# EAGLE design boardBase3 (EAGLE 8.4.0)
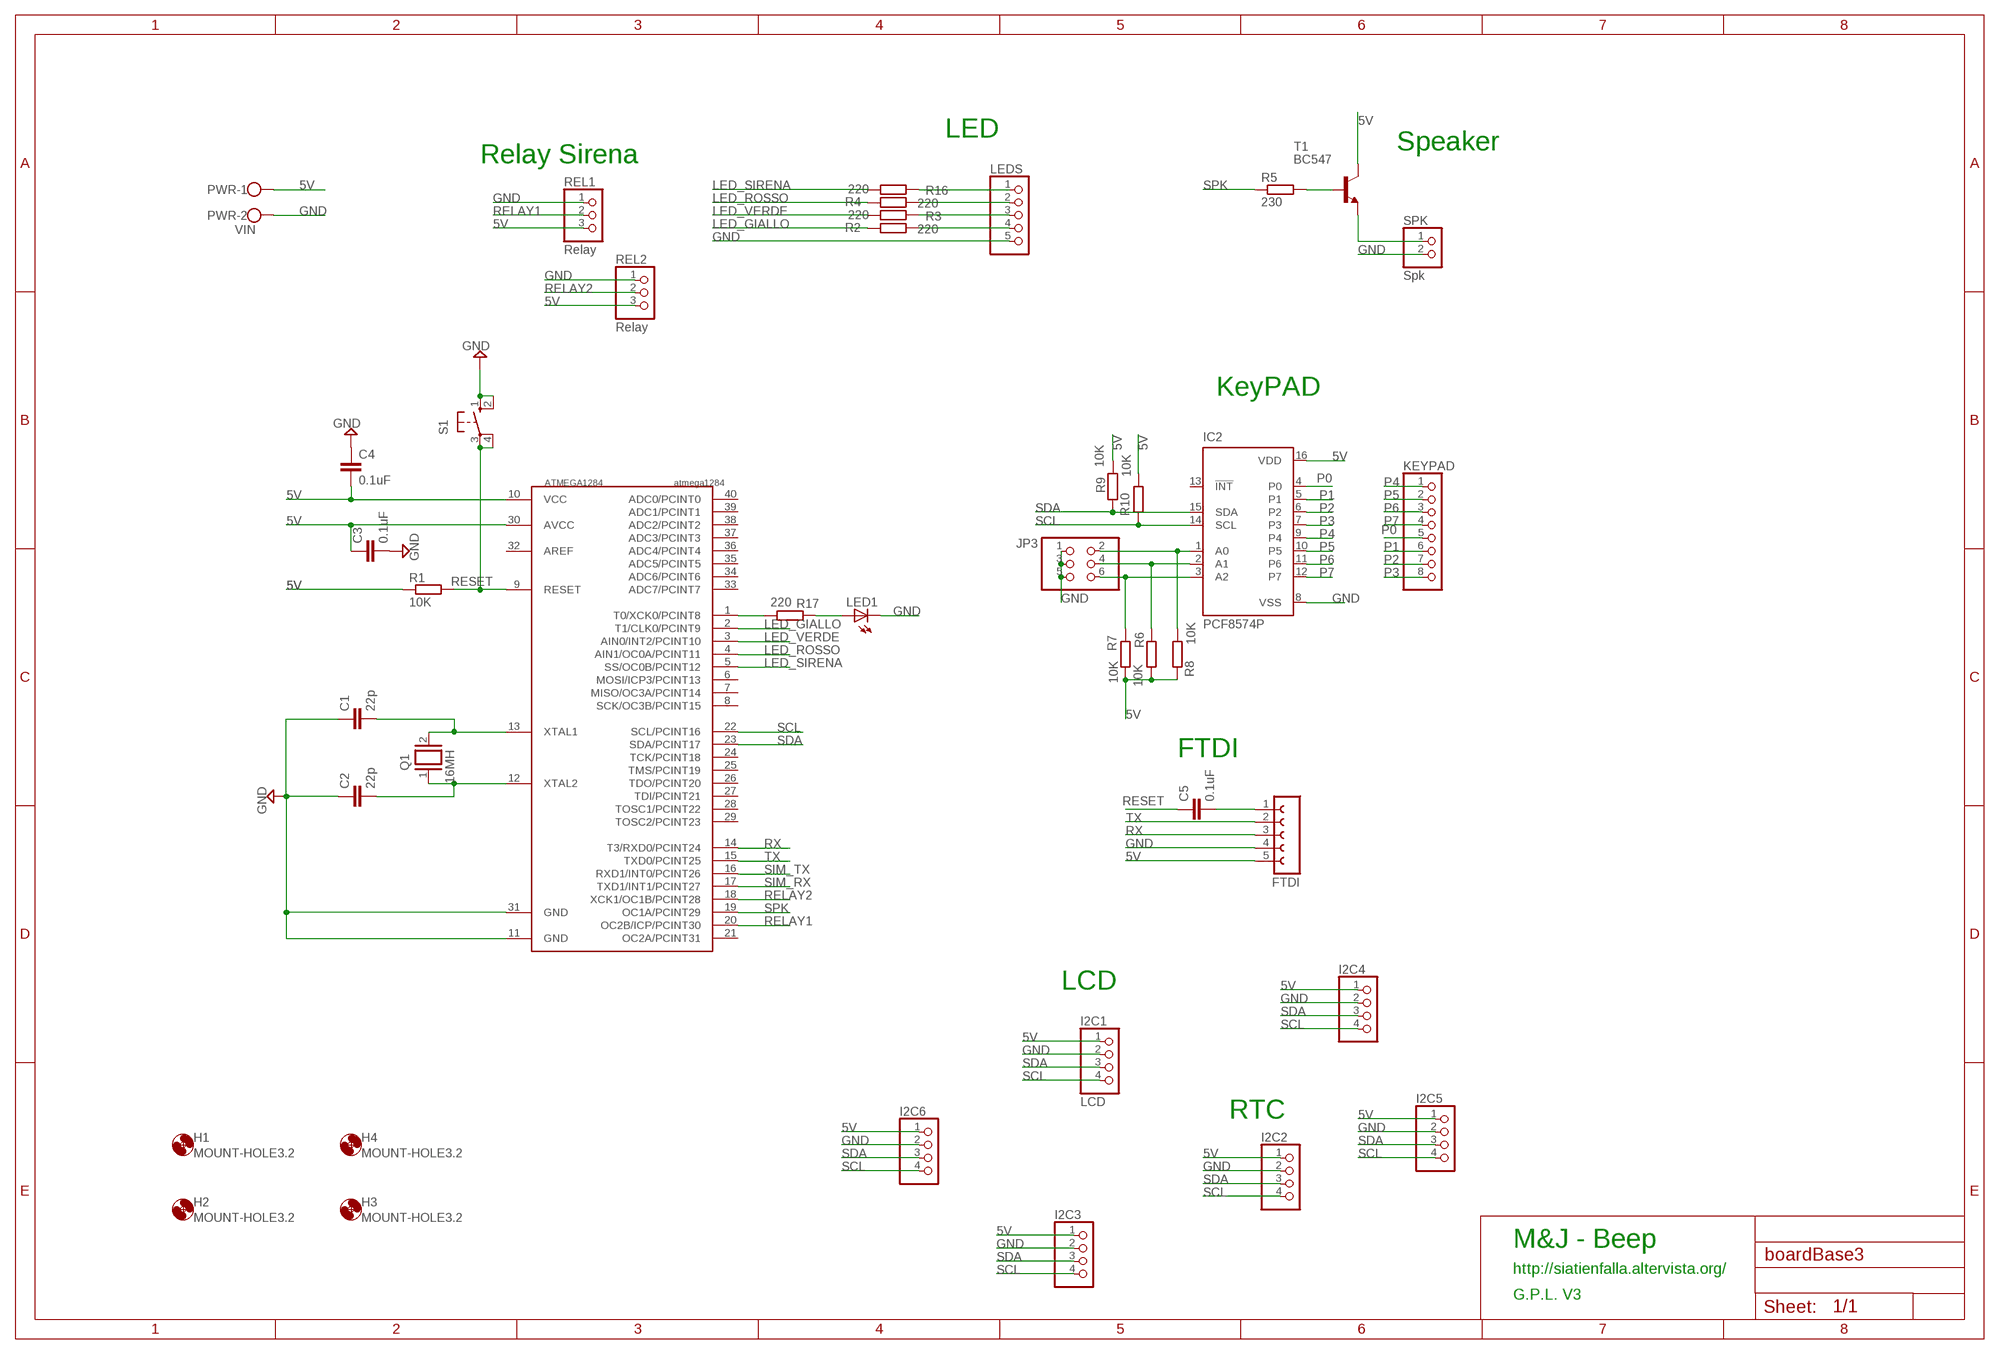
[diagram p0: schematic, sheet 1]

## Parts
ATMEGA1284  atmega1284  MEGA1284P  [DIL40]
C1  22p  C-EU025-024X044  [C025-024X044]
C2  22p  C-EU025-024X044  [C025-024X044]
C3  0.1uF  C-EU025-025X050  [C025-025X050]
C4  0.1uF  C-EU025-025X050  [C025-025X050]
C5  0.1uF  C-EU025-025X050  [C025-025X050]
FTDI  FE05-1  [FE05-1]
H1  MOUNT-HOLE3.2  [3,2]
H2  MOUNT-HOLE3.2  [3,2]
H3  MOUNT-HOLE3.2  [3,2]
H4  MOUNT-HOLE3.2  [3,2]
I2C1  LCD  PINHD-1X4  [1X04]
I2C2  PINHD-1X4  [1X04]
I2C3  PINHD-1X4  [1X04]
I2C4  PINHD-1X4  [1X04]
I2C5  PINHD-1X4  [1X04]
I2C6  PINHD-1X4  [1X04]
IC2  PCF8574P  [DIL16]
JP3  PINHD-2X3  [2X03]
KEYPAD  PINHD-1X8  [1X08]
LED1  LED3MM  [LED3MM]
LEDS  PINHD-1X5  [1X05]
PWR  VIN  W237-102  [W237-102]
Q1  16MH  XTAL/S  [QS]
R1  10K  R-EU_0207/10  [0207/10]
R2  220  R-EU_0207/2V  [0207/2V]
R3  220  R-EU_0207/2V  [0207/2V]
R4  220  R-EU_0207/2V  [0207/2V]
R5  230  R-EU_0207/2V  [0207/2V]
R6  10K  R-EU_0207/2V  [0207/2V]
R7  10K  R-EU_0207/2V  [0207/2V]
R8  10K  R-EU_0207/2V  [0207/2V]
R9  10K  R-EU_0207/2V  [0207/2V]
R10  10K  R-EU_0207/2V  [0207/2V]
R16  220  R-EU_0207/2V  [0207/2V]
R17  220  R-EU_0207/2V  [0207/2V]
REL1  Relay  PINHD-1X3  [1X03]
REL2  Relay  PINHD-1X3  [1X03]
S1  10-XX  [B3F-10XX]
SPK  Spk  PINHD-1X2  [1X02]
T1  BC547  [TO92]

## Nets
5V: ATMEGA1284.10(VCC) ATMEGA1284.30(AVCC) C3.1 C4.2 FTDI.5 I2C1.1 I2C2.1 I2C3.1 I2C4.1 I2C5.1 I2C6.1 IC2.16(VDD) PWR.1 R1.1 R6.1 R7.2 R8.2 R9.2 R10.1 REL1.3 REL2.3 T1.3(C)
GND: ATMEGA1284.11(GND) ATMEGA1284.31(GND) C1.1 C2.1 C3.2 C4.1 FTDI.4 I2C1.2 I2C2.2 I2C3.2 I2C4.2 I2C5.2 I2C6.2 IC2.8(VSS) JP3.1 JP3.3 JP3.5 LED1.K(C) LEDS.5 PWR.2 REL1.1 REL2.1 S1.1(S) S1.2(S1) SPK.2
LED_GIALLO: ATMEGA1284.2(T1/CLK0/PCINT9) R2.2
LED_ROSSO: ATMEGA1284.4(AIN1/OC0A/PCINT11) R4.2
LED_SIRENA: ATMEGA1284.5(SS/OC0B/PCINT12) R16.1
LED_VERDE: ATMEGA1284.3(AIN0/INT2/PCINT10) R3.1
N$1: ATMEGA1284.12(XTAL2) C2.2 Q1.1
N$2: ATMEGA1284.13(XTAL1) C1.2 Q1.2
N$3: IC2.1(A0) JP3.2 R8.1
N$4: C5.2 FTDI.1
N$5: IC2.2(A1) JP3.4 R6.2
N$6: IC2.3(A2) JP3.6 R7.1
N$7: LEDS.4 R2.1
N$8: LEDS.3 R3.2
N$9: LEDS.2 R4.1
N$11: R5.2 T1.2(B)
N$12: SPK.1 T1.1(E)
N$19: LEDS.1 R16.2
N$20: ATMEGA1284.1(T0/XCK0/PCINT8) R17.1
N$21: LED1.A R17.2
P0: IC2.4(P0) KEYPAD.5
P1: IC2.5(P1) KEYPAD.6
P2: IC2.6(P2) KEYPAD.7
P3: IC2.7(P3) KEYPAD.8
P4: IC2.9(P4) KEYPAD.1
P5: IC2.10(P5) KEYPAD.2
P6: IC2.11(P6) KEYPAD.3
P7: IC2.12(P7) KEYPAD.4
RELAY1: ATMEGA1284.20(OC2B/ICP/PCINT30) REL1.2
RELAY2: ATMEGA1284.18(XCK1/OC1B/PCINT28) REL2.2
RESET: ATMEGA1284.9(RESET) C5.1 R1.2 S1.3(P) S1.4(P1)
RX: ATMEGA1284.14(T3/RXD0/PCINT24) FTDI.3
SCL: ATMEGA1284.22(SCL/PCINT16) I2C1.4 I2C2.4 I2C3.4 I2C4.4 I2C5.4 I2C6.4 IC2.14(SCL) R10.2
SDA: ATMEGA1284.23(SDA/PCINT17) I2C1.3 I2C2.3 I2C3.3 I2C4.3 I2C5.3 I2C6.3 IC2.15(SDA) R9.1
SIM_RX: ATMEGA1284.17(TXD1/INT1/PCINT27)
SIM_TX: ATMEGA1284.16(RXD1/INT0/PCINT26)
SPK: ATMEGA1284.19(OC1A/PCINT29) R5.1
TX: ATMEGA1284.15(TXD0/PCINT25) FTDI.2
Unconnected: ATMEGA1284.6(MOSI/ICP3/PCINT13) ATMEGA1284.7(MISO/OC3A/PCINT14) ATMEGA1284.8(SCK/OC3B/PCINT15) ATMEGA1284.21(OC2A/PCINT31) ATMEGA1284.24(TCK/PCINT18) ATMEGA1284.25(TMS/PCINT19) ATMEGA1284.26(TDO/PCINT20) ATMEGA1284.27(TDI/PCINT21) ATMEGA1284.28(TOSC1/PCINT22) ATMEGA1284.29(TOSC2/PCINT23) ATMEGA1284.32(AREF) ATMEGA1284.33(ADC7/PCINT7) ATMEGA1284.34(ADC6/PCINT6) ATMEGA1284.35(ADC5/PCINT5) ATMEGA1284.36(ADC4/PCINT4) ATMEGA1284.37(ADC3/PCINT3) ATMEGA1284.38(ADC2/PCINT2) ATMEGA1284.39(ADC1/PCINT1) ATMEGA1284.40(ADC0/PCINT0) IC2.13(!INT)

## Notes on the sheet
- LED
- Speaker
- Relay Sirena
- KeyPAD
- FTDI
- LCD
- RTC
- M&J - Beep
- http://siatienfalla.altervista.org/
- G.P.L. V3

## Library data of the parts
ATMEGA1284 = 1284p:MEGA1284P: Atmel ATmega1284P 8-bit AVR Microcontroller
C1-C5 = rcl:C-EU: CAPACITOR, European symbol
FTDI = con-lsta:FE05-1: FEMALE HEADER; OC_FARNELL: unknown; OC_NEWARK: unknown
H1-H4 = holes:MOUNT-HOLE: MOUNTING HOLE with drill center marker
I2C1-I2C6 = pinhead:PINHD-1X4: PIN HEADER
IC2 = micro-philips:PCF8574: I2C-Bus Remote 8-bit I/O expander http://www.semiconductors.philips.com/acrobat_download/datasheets/PCF8574_4.pdf; MPN: PCF8574PN; OC_FARNELL: 204020; OC_NEWARK: 11N8515
JP3 = pinhead:PINHD-2X3: PIN HEADER
KEYPAD = pinhead:PINHD-1X8: PIN HEADER
LED1 = led:LED: LED OSRAM: - CHIPLED LG R971, LG N971, LY N971, LG Q971, LY Q971, LO R971, LY R971 LH N974, LH R974 LS Q976, LO Q976, LY Q976 LO Q996 - Hyper CHIPLED LW Q18S LB Q993, LB Q99A, LB R99A - SideLED LS A670, LO A670, LY A670, LG A670, LP A670 LB A673, LV A673, LT A673, LW A673 LH A674 LY A675 LS A676, LA A676, LO A676, LY A676, LW A676 LS A679, LY A679, LG A679 - Hyper Micro SIDELED® LS Y876, LA Y876, LO Y876, LY Y876 LT Y87S - SmartLED LW L88C, LW L88S LB L89C, LB L89S, LG L890 LS L89K, LO L89K, LY L89K LS L896, LA L896, LO L896, LY L896 - TOPLED LS T670, LO T670, LY T670, LG T670, LP T670 LSG T670, LSP T670, LSY T670, LOP T670, LYG T670 LG T671, LOG T671, LSG T671 LB T673, LV T673, LT T673, LW T673 LH T674 LS T676, LA T676, LO T676, LY T676, LB T676, LH T676, LSB T676, LW T676 LB T67C, LV T67C, LT T67C, LS T67K, LO T67K, LY T67K, LW E67C LS E67B, LA E67B, LO E67B, LY E67B, LB E67C, LV E67C, LT E67C LW T67C LS T679, LY T679, LG T679 LS T770, LO T770, LY T770, LG T770, LP T770 LB T773, LV T773, LT T773, LW T773 LH T774 LS E675, LA E675, LY E675, LS T675 LS T776, LA T776, LO T776, LY T776, LB T776 LHGB T686 LT T68C, LB T68C - Hyper Mini TOPLED® LB M676 - Mini TOPLED Santana® LG M470 LS M47K, LO M47K, LY M47K Source: http://www.osram.convergy.de LUXEON: - LUMILED® LXK2-PW12-R00, LXK2-PW12-S00, LXK2-PW14-U00, LXK2-PW14-V00 LXK2-PM12-R00, LXK2-PM12-S00, LXK2-PM14-U00 LXK2-PE12-Q00, LXK2-PE12-R00, LXK2-PE12-S00, LXK2-PE14-T00, LXK2-PE14-U00 LXK2-PB12-K00, LXK2-PB12-L00, LXK2-PB12-M00, LXK2-PB14-N00, LXK2-PB14-P00, LXK2-PB14-Q00 LXK2-PR12-L00, LXK2-PR12-M00, LXK2-PR14-Q00, LXK2-PR14-R00 LXK2-PD12-Q00, LXK2-PD12-R00, LXK2-PD12-S00 LXK2-PH12-R00, LXK2-PH12-S00 LXK2-PL12-P00, LXK2-PL12-Q00, LXK2-PL12-R00 Source: www.luxeon.com KINGBRIGHT: KA-3528ASYC Source: www.kingbright.com
LEDS = pinhead:PINHD-1X5: PIN HEADER
PWR = con-wago-500:W237-102: WAGO SCREW CLAMP; MPN: 237-102; OC_FARNELL: unknown; OC_NEWARK: 70K9898
Q1 = special:XTAL/S: CRYSTAL
R1-R10 R16 R17 = rcl:R-EU_: RESISTOR, European symbol
REL1 REL2 = pinhead:PINHD-1X3: PIN HEADER
S1 = switch-omron:10-XX: OMRON SWITCH; MPN: B3F-1000; OC_FARNELL: 176432; OC_NEWARK: 36M3542
SPK = pinhead:PINHD-1X2: PIN HEADER
T1 = transistor:BC547: NPN TRANSISTOR

## Board
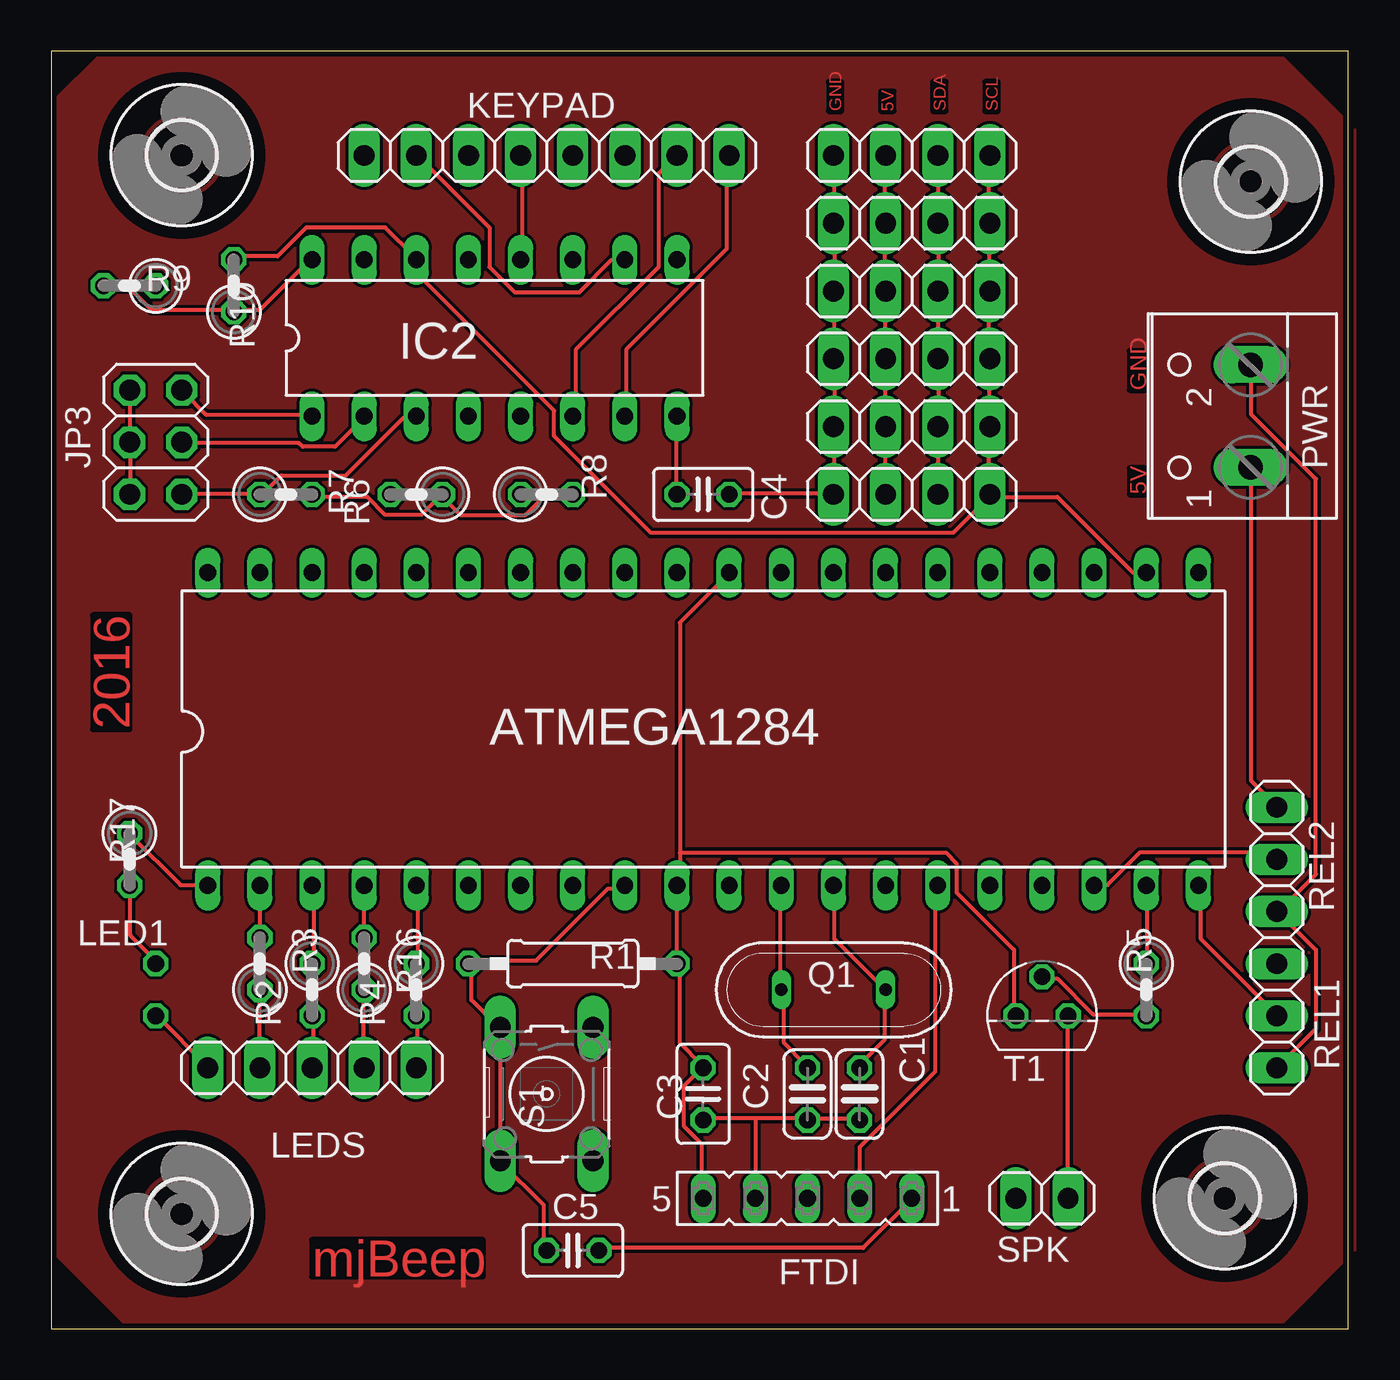
[diagram p1: board, top side]
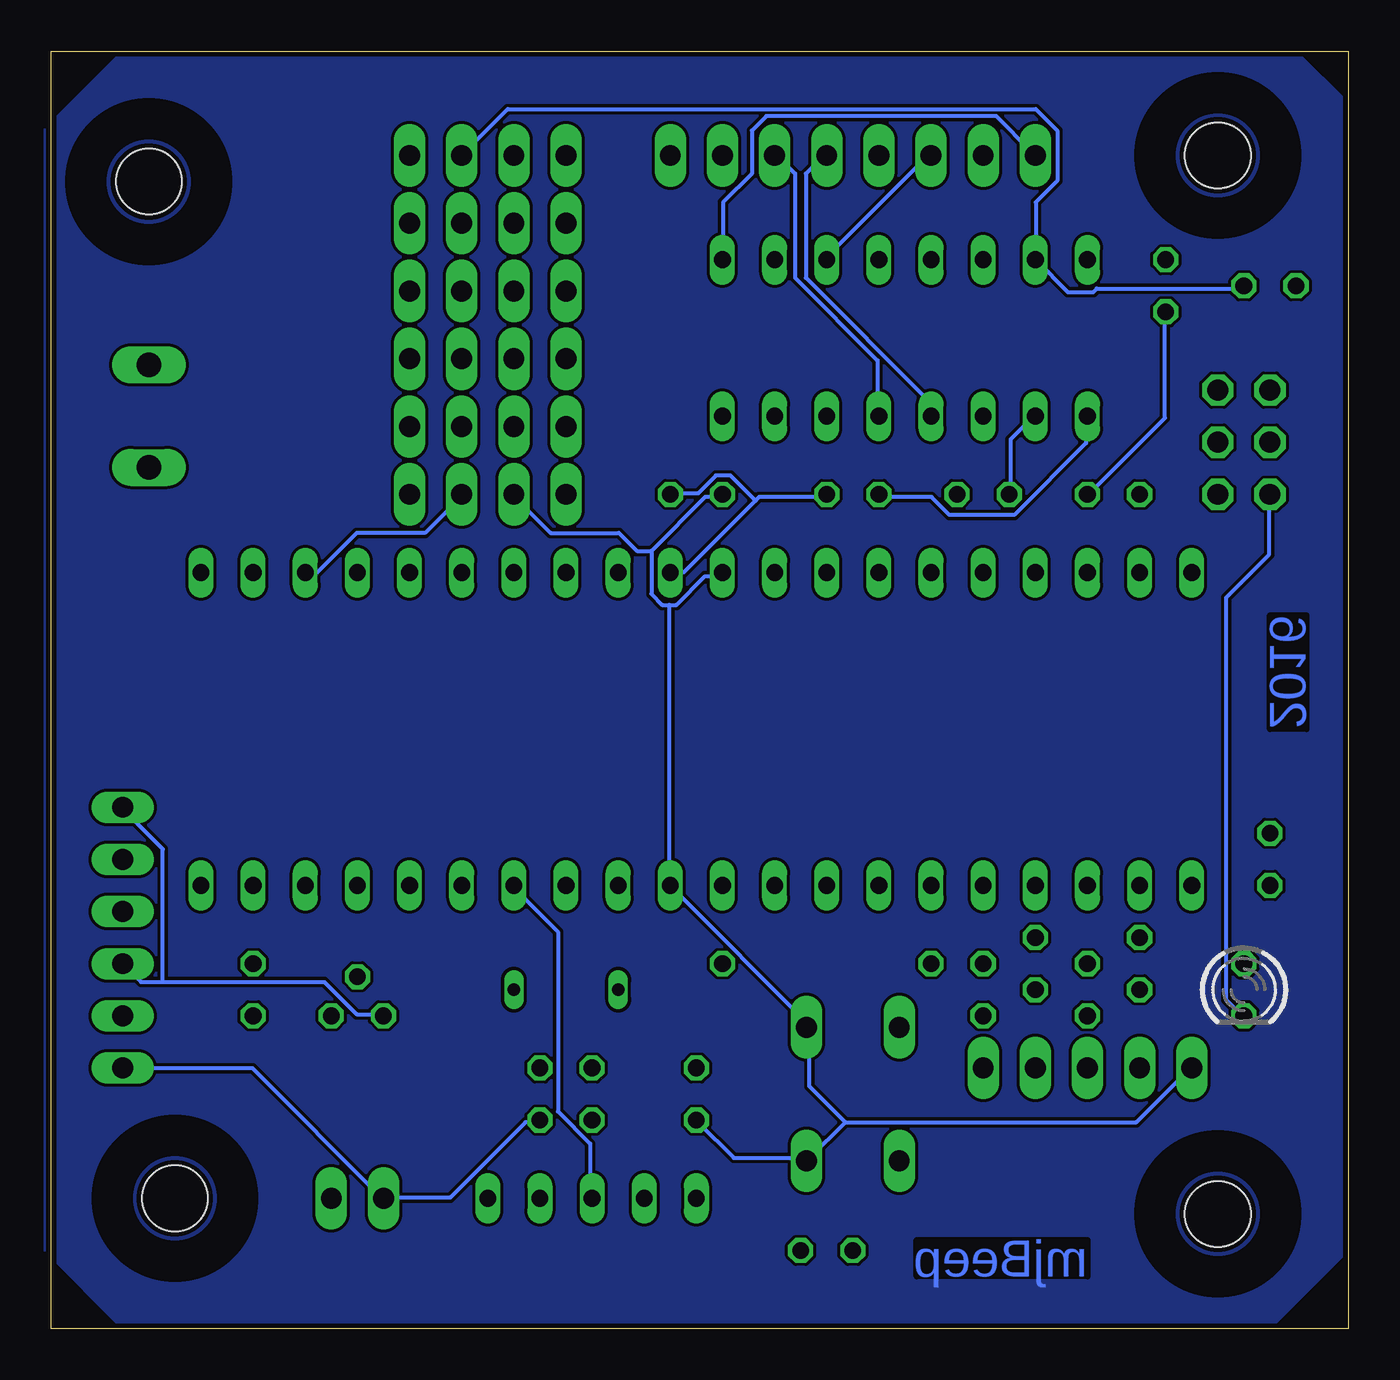
[diagram p2: board, bottom side, seen from below]

Size 63.17 x 62.22 mm. Coordinates in mm from the lower left corner, seen from the top.
Outline: 0,0 63.17,0 63.17,62.22 0,62.22 0,0
Copper layers (1*16): Top 0.018mm / dielectric 1.55mm / Bottom 0.018mm
Design rules "eC_2Layer_PClass6_BaseCopperO18_eCDefault *": minimum track width 0.2mm, minimum drill 0.35mm, track to track 0.15mm, track to pad 0.15mm, pad to pad 0.15mm, via to via 0.15mm, smd to smd 0mil, copper to edge 0.25mm, drill to drill 0.35mm, minimum pad ring 0.175mm, minimum via ring 0.125mm, stop-mask expansion 0mil, vias tented up to drill 0.45mm, thermal gap 0.2mm

### Footprints (pad centres in the part's own frame; a part is rotated, then mirrored left to right if it is on the bottom)
DIL40 = drill 0.813 long: 1 -24.13,-7.62; 2 -21.59,-7.62; 3 -19.05,-7.62; 4 -16.51,-7.62; 5 -13.97,-7.62; 6 -11.43,-7.62; 7 -8.89,-7.62; 8 -6.35,-7.62; 9 -3.81,-7.62; 10 -1.27,-7.62; 11 1.27,-7.62; 12 3.81,-7.62; 13 6.35,-7.62; 14 8.89,-7.62; 15 11.43,-7.62; 16 13.97,-7.62; 17 16.51,-7.62; 18 19.05,-7.62; 19 21.59,-7.62; 20 24.13,-7.62; 21 24.13,7.62; 22 21.59,7.62; 23 19.05,7.62; 24 16.51,7.62; 25 13.97,7.62; 26 11.43,7.62; 27 8.89,7.62; 28 6.35,7.62; 29 3.81,7.62; 30 1.27,7.62; 31 -1.27,7.62; 32 -3.81,7.62; 33 -6.35,7.62; 34 -8.89,7.62; 35 -11.43,7.62; 36 -13.97,7.62; 37 -16.51,7.62; 38 -19.05,7.62; 39 -21.59,7.62; 40 -24.13,7.62
C025-024X044 = drill 0.813 octagon: 1 -1.27,0; 2 1.27,0
C025-025X050 = drill 0.813 octagon: 1 -1.27,0; 2 1.27,0
FE05-1 = drill 0.813 long: 1 -5.08,0; 2 -2.54,0; 3 0,0; 4 2.54,0; 5 5.08,0
3,2 = hole 3.2: 0,0
1X04 = drill 1.016 long: 1 -3.81,0; 2 -1.27,0; 3 1.27,0; 4 3.81,0
DIL16 = drill 0.813 long: 1 -8.89,-3.81; 2 -6.35,-3.81; 3 -3.81,-3.81; 4 -1.27,-3.81; 5 1.27,-3.81; 6 3.81,-3.81; 7 6.35,-3.81; 8 8.89,-3.81; 9 8.89,3.81; 10 6.35,3.81; 11 3.81,3.81; 12 1.27,3.81; 13 -1.27,3.81; 14 -3.81,3.81; 15 -6.35,3.81; 16 -8.89,3.81
2X03 = drill 1.016 octagon: 1 -2.54,-1.27; 2 -2.54,1.27; 3 0,-1.27; 4 0,1.27; 5 2.54,-1.27; 6 2.54,1.27
1X08 = drill 1.016 long: 1 -8.89,0; 2 -6.35,0; 3 -3.81,0; 4 -1.27,0; 5 1.27,0; 6 3.81,0; 7 6.35,0; 8 8.89,0
LED3MM = drill 0.813 octagon: A -1.27,0; K 1.27,0
1X05 = drill 1.016 long: 1 -5.08,0; 2 -2.54,0; 3 0,0; 4 2.54,0; 5 5.08,0
W237-102 = drill 1.194 long: 1 -2.5,-1.27; 2 2.5,-1.27
QS = drill 0.61 long: 1 -2.54,0; 2 2.54,0
0207/10 = drill 0.813 octagon: 1 -5.08,0; 2 5.08,0
0207/2V = drill 0.813 octagon: 1 -1.27,0; 2 1.27,0
1X03 = drill 1.016 long: 1 -2.54,0; 2 0,0; 3 2.54,0
B3F-10XX = drill 1.016 long: 1 -3.251,2.261; 2 3.251,2.261; 3 -3.251,-2.261; 4 3.251,-2.261
1X02 = drill 1.016 long: 1 -1.27,0; 2 1.27,0
TO92 = drill 0.813 octagon: 1 1.27,0; 2 0,1.905; 3 -1.27,0

### Placement (x,y rotation side)
ATMEGA1284  31.75,29.21 0 top
C1  39.37,11.43 90 top
C2  36.83,11.43 90 top
C3  31.75,11.43 270 top
C4  31.75,40.64 0 top
C5  25.4,3.81 0 top
FTDI  36.83,6.35 180 top
H1  6.35,5.59 0 top
H2  6.35,57.15 0 top
H3  58.42,55.88 0 top
H4  57.15,6.35 0 top
I2C1  41.91,40.64 0 top
I2C2  41.91,43.94 0 top
I2C3  41.91,47.24 0 top
I2C4  41.91,50.55 0 top
I2C5  41.91,53.85 0 top
I2C6  41.91,57.15 0 top
IC2  21.59,48.26 0 top
JP3  5.08,43.18 270 top
KEYPAD  24.13,57.15 0 top
LED1  5.08,16.51 270 bottom
LEDS  12.7,12.7 180 top
PWR  57.15,44.45 90 top
Q1  38.1,16.51 0 top
R1  25.4,17.78 180 top
R2  10.16,17.78 90 top
R3  12.7,16.51 270 top
R4  15.24,17.78 90 top
R5  53.34,16.51 270 top
R6  17.78,40.64 180 top
R7  11.43,40.64 0 top
R8  24.13,40.64 0 top
R9  3.81,50.8 180 top
R10  8.89,50.8 90 top
R16  17.78,16.51 270 top
R17  3.81,22.86 270 top
REL1  59.69,15.24 90 top
REL2  59.69,22.86 90 top
S1  24.13,11.43 270 top
SPK  48.26,6.35 180 top
T1  48.26,15.24 0 top

### Tracks (layer width: path | path; a pad name or v marks a point on that pad's centre or on a via)
5V
  Top 0.2: PWR.1 58.45,41.91 58.45,26.69 59.67,25.46 REL2.3 | I2C6.1 38.15,57.13 38.15,53.98 I2C5.1 38.15,53.81 38.15,50.66 I2C4.1 38.15,50.48 38.15,47.34 I2C3.1 38.15,47.16 38.15,44.01 I2C2.1 38.15,43.84 38.15,40.69 I2C1.1 37.97,40.69 33.07,40.69 C4.2 | FTDI.5 31.67,6.39 31.67,9.01 30.8,9.89 30.8,11.81 31.67,12.68 C3.1 31.67,12.86 30.62,13.91 30.62,17.76 R1.1 30.45,17.94 30.45,21.44 ATMEGA1284.10 30.62,21.61 30.62,23.19 | IC2.16 12.6,52.06 10.14,49.61 8.92,49.61 R10.1 8.74,49.61 4.89,49.61 3.85,50.66 2.62,50.66 R9.2 | R7.2 12.77,40.51 15.4,40.51 16.27,39.63 18.02,39.63 18.9,40.51 R6.1 19.07,40.51 19.95,39.63 23.09,39.63 23.97,40.51 25.37,40.51 R8.2 | 30.62,23.19 30.62,34.38 32.9,36.66 ATMEGA1284.30 | 30.62,23.19 43.57,23.19 44.09,22.66 44.09,21.26 46.9,18.46 46.9,15.31 T1.3
  Bottom 0.2: 57.75,16.89 58.8,16.89 REL1.3 | 57.75,16.89 49.87,16.89 48.3,15.31 47.07,15.31 T1.3 | 57.75,16.89 57.75,23.36 59.67,25.29 REL2.3 | 28.87,40.34 28.7,40.51 25.55,40.51 R8.2 | 28.87,40.34 32.37,36.84 32.9,36.84 ATMEGA1284.30 | R10.1 8.92,49.44 8.92,44.36 12.6,40.69 R7.2 | 28.87,40.34 30.09,41.56 30.8,41.56 31.67,40.69 32.9,40.69 C4.2
GND
  Top 0.2: REL1.1 59.84,12.86 61.59,14.61 61.59,18.46 59.84,20.21 REL2.1 59.84,20.39 61.59,22.14 61.59,41.38 58.45,44.54 58.45,46.81 PWR.2 | IC2.8 30.45,44.36 30.45,40.69 C4.1 | I2C1.2 40.59,40.69 40.59,43.84 I2C2.2 40.59,44.01 40.59,47.16 I2C3.2 40.59,47.34 40.59,50.48 I2C4.2 40.59,50.66 40.59,53.81 I2C5.2 40.59,53.98 40.59,57.13 I2C6.2 | JP3.5 3.85,40.69 3.85,43.13 JP3.3 3.85,43.31 3.85,45.59 JP3.1 | LED1.K 5.24,15.14 7.52,12.86 LEDS.5 | 34.3,10.23 36.75,10.23 C2.1 36.92,10.23 39.37,10.23 C1.1 | 34.3,10.23 31.84,10.23 C3.2 | 34.3,10.23 34.3,6.39 FTDI.4
  Bottom 0.2: 33.07,35.26 33.42,35.26 33.95,35.79 33.95,37.88 | 33.07,35.26 32.72,35.26 31.32,36.66 30.62,36.66 ATMEGA1284.31 | 33.95,37.88 31.32,40.51 30.62,40.51 C4.1 | 33.95,37.88 34.65,37.88 35.52,38.76 38.84,38.76 40.59,40.51 I2C1.2 | C3.2 31.67,10.06 29.92,8.31 26.42,8.31 S1.2 26.24,8.31 24.49,10.06 | C1.1 39.37,10.06 40.07,10.06 43.75,6.39 46.9,6.39 SPK.2 47.07,6.39 53.37,12.68 59.67,12.68 REL1.1 | 24.49,10.06 10.32,10.06 7.7,12.68 LEDS.5 | JP3.5 3.85,40.51 3.85,37.71 5.95,35.61 5.95,16.01 5.24,15.31 LED1.K | 24.49,10.06 26.24,11.81 26.24,14.61 S1.1 26.24,14.79 32.9,21.44 ATMEGA1284.11 33.07,21.61 33.07,35.26
LED_GIALLO
  Top 0.2: R2.2 10.14,19.16 10.14,21.44 ATMEGA1284.2
LED_ROSSO
  Top 0.2: R4.2 15.22,19.16 15.22,21.44 ATMEGA1284.4
LED_SIRENA
  Top 0.2: R16.1 17.84,17.94 17.84,21.44 ATMEGA1284.5
LED_VERDE
  Top 0.2: R3.1 12.77,17.94 12.77,21.44 ATMEGA1284.3
N$1
  Top 0.2: C2.2 36.75,12.86 35.7,13.91 35.7,16.36 Q1.1 35.52,16.54 35.52,21.44 ATMEGA1284.12
N$2
  Top 0.2: C1.2 39.37,12.86 40.59,14.09 40.59,16.36 Q1.2 40.59,16.54 38.15,18.98 38.15,21.44 ATMEGA1284.13
N$3
  Top 0.2: IC2.1 12.6,44.54 7.52,44.54 6.47,45.59 JP3.2
  Bottom 0.2: R8.1 22.74,40.51 20.3,40.51 19.42,39.63 16.27,39.63 12.77,43.13 12.77,44.36 IC2.1
N$4
  Top 0.2: C5.2 26.77,3.93 39.55,3.93 41.82,6.21 FTDI.1
N$5
  Top 0.2: JP3.4 6.47,43.13 12.07,43.13 12.24,42.96 13.82,42.96 15.22,44.36 IC2.2
  Bottom 0.2: R6.2 16.45,40.69 16.45,43.31 15.4,44.36 IC2.2
N$6
  Top 0.2: JP3.6 6.47,40.69 10.14,40.69 R7.1 10.32,40.69 11.19,41.56 14.35,41.56 17.15,44.36 17.67,44.36 IC2.3
N$7
  Top 0.2: R2.1 10.14,16.36 10.14,12.86 LEDS.4
N$8
  Top 0.2: R3.2 12.77,15.14 12.77,12.86 LEDS.3
N$9
  Top 0.2: R4.1 15.22,16.36 15.22,12.86 LEDS.2
N$10
  pour Top: 0,59.69 2.54,62.23 59.69,62.23 63.5,58.42 63.5,3.81 59.69,0 3.81,0 0,3.81
N$11
  Top 0.2: R5.2 53.2,15.31 50.75,15.31 49,17.06 48.3,17.06 T1.2
N$12
  Top 0.2: T1.1 49.52,15.14 49.52,6.39 SPK.1
N$13
  pour Bottom: 0,59.69 2.54,62.23 59.69,62.23 63.5,58.42 63.5,3.81 59.69,0 3.81,0 0,3.81
N$19
  Top 0.2: R16.2 17.84,15.14 17.84,12.86 LEDS.1
N$20
  Top 0.2: ATMEGA1284.1 7.52,21.61 6.29,21.61 3.85,24.06 R17.1
N$21
  Top 0.2: R17.2 3.85,21.44 3.85,19.16 5.07,17.94 LED1.A
P0
  Bottom 0.2: IC2.4 20.47,44.54 20.47,45.23 26.42,51.19 26.42,56.26 25.55,57.13 KEYPAD.5
P1
  Bottom 0.2: IC2.5 22.92,44.54 22.92,47.16 26.95,51.19 26.95,56.26 27.82,57.13 KEYPAD.6
P2
  Top 0.2: IC2.6 25.55,44.54 25.55,47.69 29.57,51.71 29.57,56.26 30.45,57.13 KEYPAD.7
P3
  Top 0.2: IC2.7 28,44.54 28,47.69 32.9,52.59 32.9,57.13 KEYPAD.8
P4
  Bottom 0.2: IC2.9 30.45,52.23 30.45,54.86 29.05,56.26 29.05,58.36 28.34,59.06 17.15,59.06 15.4,57.31 KEYPAD.1
P5
  Top 0.2: IC2.10 27.82,52.06 27.3,52.06 25.72,50.48 22.57,50.48 21.34,51.71 21.34,53.63 17.84,57.13 KEYPAD.2
P6
  Bottom 0.2: IC2.11 25.37,52.23 20.47,57.13 KEYPAD.3
P7
  Top 0.2: IC2.12 22.92,52.23 22.92,57.13 KEYPAD.4
RELAY1
  Top 0.2: ATMEGA1284.20 56,21.44 56,18.98 59.67,15.31 REL1.2
RELAY2
  Top 0.2: ATMEGA1284.18 50.92,21.61 51.45,21.61 53.02,23.19 59.5,23.19 59.67,23.01 REL2.2
RESET
  Top 0.2: C5.1 23.97,3.93 23.97,6.03 21.87,8.14 S1.4 21.87,8.31 21.87,14.61 S1.3 21.7,14.79 20.47,16.01 20.47,17.76 R1.2 20.47,17.94 23.62,17.94 27.12,21.44 27.82,21.44 ATMEGA1284.9
RX
  Bottom 0.2: FTDI.3 36.92,6.39 36.92,9.01 38.5,10.59 38.5,19.34 40.59,21.44 ATMEGA1284.14
SCL
  Top 0.2: R10.2 8.92,52.23 11.02,52.23 12.42,53.63 16.27,53.63 17.67,52.23 IC2.14 17.84,52.06 17.84,51.36 24.49,44.71 24.49,43.48 29.22,38.76 43.92,38.76 45.67,40.51 I2C1.4 | I2C6.4 45.67,57.13 45.67,53.98 I2C5.4 45.67,53.81 45.67,50.66 I2C4.4 45.67,50.48 45.67,47.34 I2C3.4 45.67,47.16 45.67,44.01 I2C2.4 45.67,43.84 45.67,40.69 I2C1.4 | ATMEGA1284.22 53.2,36.84 52.67,36.84 49,40.51 45.84,40.51 I2C1.4
SDA
  Top 0.2: I2C6.3 43.22,57.13 43.22,53.98 I2C5.3 43.22,53.81 43.22,50.66 I2C4.3 43.22,50.48 43.22,47.34 I2C3.3 43.22,47.16 43.22,44.01 I2C2.3 43.22,43.84 43.22,40.69 I2C1.3
  Bottom 0.2: R9.1 5.24,50.66 12.24,50.66 12.42,50.48 13.65,50.48 15.22,52.06 IC2.15 15.22,52.23 15.22,54.86 14.17,55.91 14.17,58.36 15.22,59.41 40.95,59.41 43.05,57.31 I2C6.3 | ATMEGA1284.23 50.75,36.84 50.22,36.84 48.3,38.76 44.97,38.76 43.22,40.51 I2C1.3
SPK
  Top 0.2: R5.1 53.37,17.94 53.37,21.44 ATMEGA1284.19
TX
  Top 0.2: FTDI.2 39.37,8.84 43.05,12.51 43.05,21.44 ATMEGA1284.15

### Text on the board
Top: GND | 5V | SDA | SCL | GND | 5V | 2016 | mjBeep
Bottom: 2016 | mjBeep